# Altium schematic sheet Power.SchDoc
size A3; SheetNumber: 4; SheetTotal: 5
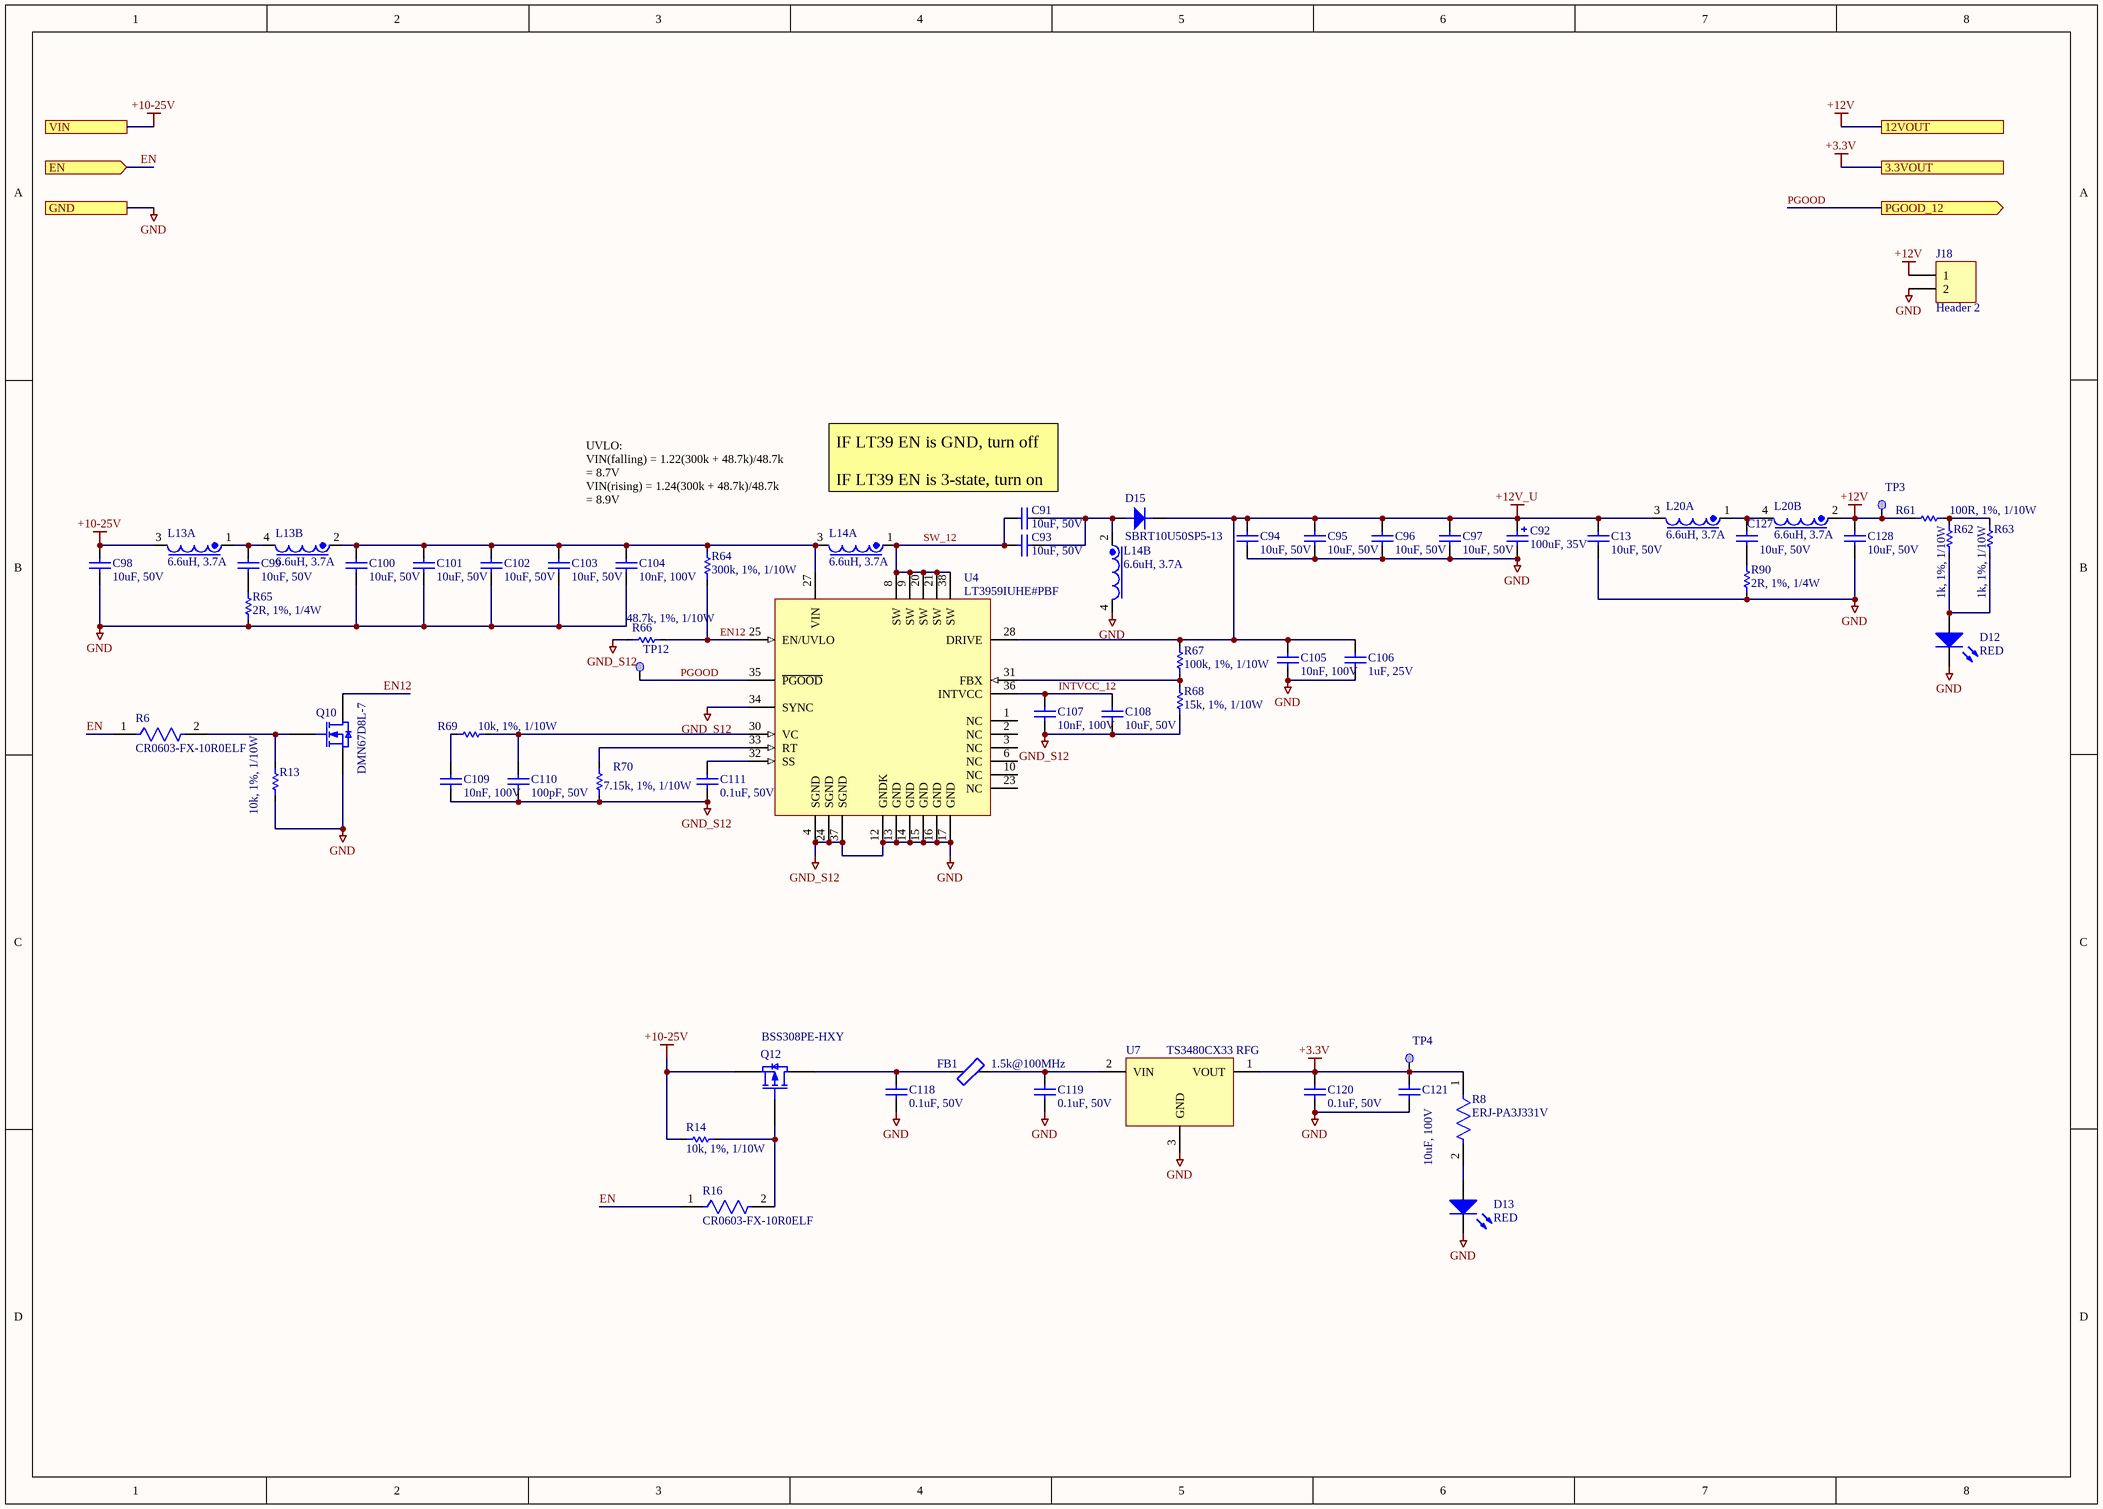
[diagram p0: Power.SchDoc]

## Parts
C13  10uF, 50V  [1206]
C91  10uF, 50V  [1206]
C92  100uF, 35V  [CAPAE7866X80L]
C93  10uF, 50V  [1206]
C94  10uF, 50V  [1206]
C95  10uF, 50V  [1206]
C96  10uF, 50V  [1206]
C97  10uF, 50V  [1206]
C98  10uF, 50V  [1206]
C99  10uF, 50V  [1206]
C100  10uF, 50V  [1206]
C101  10uF, 50V  [1206]
C102  10uF, 50V  [1206]
C103  10uF, 50V  [1206]
C104  10nF, 100V  [0603]
C105  10nF, 100V  [0603]
C106  1uF, 25V  [0603]
C107  10nF, 100V  [0603]
C108  10uF, 50V  [1206]
C109  10nF, 100V  [0603]
C110  100pF, 50V  [0603]
C111  0.1uF, 50V  [0603]
C118  0.1uF, 50V  [0603]
C119  0.1uF, 50V  [0603]
C120  0.1uF, 50V  [0603]
C121  10uF, 100V  [1210]
C127  10uF, 50V  [1206]
C128  10uF, 50V  [1206]
D12  RED  [0603_DIODE_K1A2]
D13  RED  [0603_DIODE_K1A2]
D15  SBRT10U50SP5-13  [DPAK184P650X115-3L]
FB1  1.5k@100MHz  [0805]
J18  Header 2  [CONN-TH_2P-P2.50_HX25003-2A]
L13  6.6uH, 3.7A  [PLCC300P1250X1250X600-4N]  (parts A,B of 2)
L14  6.6uH, 3.7A  [PLCC300P1250X1250X600-4N]  (parts A,B of 2)
L20  6.6uH, 3.7A  [PLCC300P1250X1250X600-4N]  (parts A,B of 2)
Q10  DMN67D8L-7  [SOT23-3]
Q12  BSS308PE-HXY  [SOT23-3]
R6  CR0603-FX-10R0ELF  [FP-CR0603-MFG]
R8  ERJ-PA3J331V  [FP-ERJPA3-MFG]
R13  10k, 1%, 1/10W  [0603]
R14  10k, 1%, 1/10W  [0603]
R16  CR0603-FX-10R0ELF  [FP-CR0603-MFG]
R61  100R, 1%, 1/10W  [0603]
R62  1k, 1%, 1/10W  [0603]
R63  1k, 1%, 1/10W  [0603]
R64  300k, 1%, 1/10W  [0603]
R65  2R, 1%, 1/4W  [1206]
R66  48.7k, 1%, 1/10W  [0603]
R67  100k, 1%, 1/10W  [0603]
R68  15k, 1%, 1/10W  [0603]
R69  10k, 1%, 1/10W  [0603]
R70  7.15k, 1%, 1/10W  [0603]
R90  2R, 1%, 1/4W  [1206]
TP3  Test Point  [TEST POINT 40 Mil]  (value not drawn)  (no BOM)
TP4  Test Point  [TEST POINT 40 Mil]  (value not drawn)  (no BOM)
TP12  Test Point  [TEST POINT 40 Mil]  (value not drawn)  (no BOM)
U4  LT3959IUHE#PBF  [QFN50P500X600X80_LT_UHEMA]
U7  TS3480CX33 RFG  [SOT23-3]

## Ports
3.3VOUT, 12VOUT, EN (in), GND, PGOOD_12 (out), VIN

## Nets
+3.3V: C120.1 C121.2 R8.1 TP4.1 U7.1(VOUT) ; port 3.3VOUT
+10-25V: C98.2 L13.3 Q12.3(S) R14.1 ; port VIN
+12V: C128.2 J18.1 L20.2 R61.2 TP3.1 ; port 12VOUT
+12V_U: C13.2 C92.1 C94.2 C95.2 C96.2 C97.2 C105.2 C106.2 D15.2(K) L20.3 R67.2 U4.28(DRIVE)
GND: C13.1 C92.2 C94.1 C95.1 C96.1 C97.1 C98.1 C100.1 C101.1 C102.1 C103.1 C104.1 C105.1 C106.1 C107.1 C108.1 C109.1 C110.1 C111.2 C118.2 C119.2 C120.2 C121.1 C128.1 D12.2(K) D13.2(K) J18.2 L14.4 Q10.2(S) R13.2 R65.1 R66.2 R68.1 R70.1 R90.1 U4.4(SGND) U4.12(GNDK) U4.13(GND) U4.14(GND) U4.15(GND) U4.16(GND) U4.17(GND) U4.24(SGND) U4.34(SYNC) U4.37(SGND) U7.3(GND) ; port GND  [also labelled GND_S12]
EN: R6.1 R16.1 ; port EN
EN12: Q10.3(D) R64.1 R66.1 U4.25(EN/UVLO)
INTVCC_12: C107.2 C108.2 U4.36(INTVCC)
PGOOD: TP12.1 U4.35(~{PGOOD}) ; port PGOOD_12
SW_12: C91.1 C93.1 L14.1 U4.8(SW) U4.9(SW) U4.20(SW) U4.21(SW) U4.38(SW)
NetC91_2: C91.2 C93.2 D15.1(A) L14.2
NetC99_1: C99.1 R65.2
NetC99_2: C99.2 L13.1 L13.4
NetC100_2: C100.2 C101.2 C102.2 C103.2 C104.2 L13.2 L14.3 R64.2 U4.27(VIN)
NetC109_2: C109.2 R69.2
NetC110_2: C110.2 R69.1 U4.30(VC)
NetC111_1: C111.1 U4.32(SS)
NetC118_1: C118.1 FB1.1 Q12.2(D)
NetC119_1: C119.1 FB1.2 U7.2(VIN)
NetC127_1: C127.1 R90.2
NetC127_2: C127.2 L20.1 L20.4
NetD12_1: D12.1(A) R62.2 R63.2
NetD13_1: D13.1(A) R8.2
NetQ10_1: Q10.1(G) R6.2 R13.1
NetQ12_1: Q12.1(G) R14.2 R16.2
NetR61_1: R61.1 R62.1 R63.1
NetR67_1: R67.1 R68.2 U4.31(FBX)
NetR70_2: R70.2 U4.33(RT)

Not connected (* = marked no-connect by the designer): U4 1(NC) 2(NC) 3(NC) 6(NC) 10(NC) 23(NC)

## Notes on the sheet
- (near C91) IF LT39 EN is GND, turn off
  IF LT39 EN is 3-state, turn on
- UVLO:
  VIN(falling) = 1.22(300k + 48.7k)/48.7k
  = 8.7V
  VIN(rising) = 1.24(300k + 48.7k)/48.7k
  = 8.9V

## Library data of the parts
C13 C91 C93-C103 C108 C127 C128 = NS00832: CAP CER 10UF 50V X7R 1206; Type: C; Alternatives: Generic; Part Number: NS00832; Value: 10uF, 50V; Supplier 1: Digi-Key; Supplier Part Number 1: 1276-6767-1-ND
C92 = NS00911: CAP ALUM 100UF 20% 35V SMD; Type: C; Alternatives: Generic; Part Number: NS00911; Value: 100uF, 35V; Supplier 1: Digi-Key; Supplier Part Number 1: PCE5051CT-ND
C104 C105 C107 C109 = NS00848: CAP CER 10000PF 100V C0G 0603; Type: C; Alternatives: Generic; Part Number: NS00848; Value: 10nF, 100V; Supplier 1: Digi-Key; Supplier Part Number 1: 445-172665-1-ND
C106 = NS00836: CAP CER 1UF 25V X7R 0603; Type: C; Alternatives: Generic; Part Number: NS00836; Value: 1uF, 25V; Supplier 1: Digi-Key; Supplier Part Number 1: 1276-1184-1-ND
C110 = NS00840: CAP CER 100PF 50V C0G/NP0 0603; Type: C; Alternatives: Generic; Part Number: NS00840; Value: 100pF, 50V; Supplier 1: Digi-Key; Supplier Part Number 1: 478-1175-1-ND
C111 C118-C120 = NS00838: CAP CER 0.1UF 50V X7R 0603; Type: C; Alternatives: Generic; Part Number: NS00838; Value: 0.1uF, 50V; Supplier 1: Digi-Key; Supplier Part Number 1: 1276-1935-1-ND
C121 = NS00779: MLCC 10UF 100V X7S 1210; Type: C; Alternatives: Generic; Part Number: NS00779; Value: 10uF, 100V; Supplier 1: Digi-Key; Supplier Part Number 1: 1276-CL32Y106KCVZNWECT-ND
D12 D13 = NS00945: LED RED CLEAR 1608 SMD; Type: IC; Part Number: NS00945; Value: RED; ComponentLink1Description: Datasheet; ComponentLink1URL: H:\Doc\Harvatek\B1911USD-20D000114U1930.pdf; Supplier 1: Digi-Key; Supplier Part Number 1: 3147-B1911USD-20D000114U1930CT-ND
D15 = NS00833: DIODE SBR 50V 10A POWERDI5; Part Number: NS00833; Type: Diode; Value: SBRT10U50SP5-13; ComponentLink1Description: Datasheet; ComponentLink1URL: H:\Doc\Diodes\SBRT10U50SP5.pdf; Supplier 1: Digi-Key; Supplier Part Number 1: SBR10E45P5-7DICT-ND
FB1 = NS00881: WE-CBA SMT EMI SUPPRESSION FERRITE; Type: Inductor; Part Number: NS00881; Value: 1.5k@100MHz; ComponentLink1Description: Datasheet; ComponentLink1URL: H:\Doc\Wurth\782853162.pdf; Supplier 1: Digi-Key; Supplier Part Number 1: 732-782853162CT-ND
J18 = Header 2: Header, 2-Pin; LatestRevisionDate: 17-Jul-2002; LatestRevisionNote: Re-released for DXP Platform.; Publisher: Altium Limited; Supplier 1: Digi-Key; Supplier Part Number 1: 455-B2B-XH-A-ND
L13 L14 L20 = NS00831: INDUCT ARRAY 2 COIL 6.6UH SMD; Type: Inductor; Part Number: NS00831; Value: 6.6uH, 3.7A; ComponentLink1Description: Datasheet; ComponentLink1URL: H:\Doc\pulse\SPM2007_28.pdf; Supplier 1: Digi-Key; Supplier Part Number 1: 553-3631-ND
Q10 = NS00873: MOSFET N-CH 60V 210MA SOT23; Type: IC; Published: 8-Jun-2000; LatestRevisionDate: 17-Jul-2002; LatestRevisionNote: Re-released for DXP Platform.; PackageVersion: 1995/1996; PackageReference: E3; Publisher: Altium Limited; Part Number: NS00873; Value: DMN67D8L-7; ComponentLink1Description: Datasheet; ComponentLink1URL: H:\Doc\Diodes\DMN67D8L.pdf; Supplier 1: Digi-Key; Supplier Part Number 1: DMN67D8L-7DICT-ND
Q12 = NS00810: P-CHANNEL MOSFET; Type: IC; Part Number: NS00810; Value: BSS308PE-HXY; ComponentLink1Description: Datasheet; ComponentLink1URL: H:\Doc\MicroCommercial\MCU45P03A(DPAK).pdf; Supplier 1: Digi-Key; Supplier Part Number 1: 353-MCU45P03A-TPCT-ND
R6 R16 = CMP-1012-00284-2: Thick Film Chip Resistors 0603 10Ω 0.1W 1% 100ppm/°C; Max Power Dissipation: 100mW; Resistance: 10R; Voltage Rating: 50V; Depth: 0.8mm; REACH SVHC: No SVHC; Package Quantity: 1; Thickness: 457um; Length: 1.6mm; Tolerance: 1%; Width: 0.8mm; Number of Pins: 2; Height: 0.45mm; Military Standard: Not; Features: Moisture Resistant; Packaging: Tape and Reel; Case/Package: 0603; Power Rating: 100mW; Voltage Rating (DC): 50V; Radiation Hardening: No; Mount: Surface Mount; Min Operating Temperature: -55°C; Composition: Thick Film; Max Operating Temperature: 155°C; Termination: SMD/SMT; Temperature Coefficient: 100ppm/°C; Case Code (Imperial): 0603; Case Code (Metric): 1608; Number of Terminations: 2; Contact Plating: Tin
R8 = CMP-05422-000096-1: RES SMD 330 OHM 5% 1/4W 0603; Resistance: 330R; Temperature Coefficient: 200ppm/°C; Max Power Dissipation: 250mW; Case Code (Imperial): 0603; Height: 0.018inch; Case/Package: 0603; Case Code (Metric): 1608; Width: 0.031inch; Length: 0.063inch; Tolerance: 5%; Features: Automotive AEC-Q200; Min Operating Temperature: -55°C; Max Operating Temperature: 155°C; Resistor Type: Thick Film; Packaging: Cut Tape; Number of Terminations: 2; Parameter 1: *; Parameter 2: *
R13 R14 R69 = NS00820: RES 10K OHM 1% 1/10W 0603; Alternatives: Generic; Part Number: NS00820; Type: R; Value: 10k, 1%, 1/10W; Supplier 1: Digi-Key; Supplier Part Number 1: RMCF0603FT10K0CT-ND
R61 = NS00870: RES 100 OHM 1% 1/10W 0603; Alternatives: Generic; Part Number: NS00870; Type: R; Value: 100R, 1%, 1/10W; Supplier 1: Digi-Key; Supplier Part Number 1: RMCF0603FT100RCT-ND
R62 R63 = NS00882: RES 1K OHM 1% 1/10W 0603; Alternatives: Generic; Part Number: NS00882; Type: R; Value: 1k, 1%, 1/10W; Supplier 1: Digi-Key; Supplier Part Number 1: RMCF0603FT1K00CT-ND
R64 = NS00837: RES 300K OHM 1% 1/10W 0603; Alternatives: Generic; Part Number: NS00837; Type: R; Value: 300k, 1%, 1/10W; Supplier 1: Digi-Key; Supplier Part Number 1: RMCF0603FT300KCT-ND
R65 R90 = NS00946: RES 2 OHM 1% 1/4W 1206; Alternatives: Generic; Part Number: NS00946; Type: R; Value: 2R, 1%, 1/4W; Supplier 1: Digi-Key; Supplier Part Number 1: 738-RMCF1206FT2R00CT-ND
R66 = NS00826: RES 48.7K OHM 1% 1/10W 0603; Alternatives: Generic; Part Number: NS00826; Type: R; Value: 48.7k, 1%, 1/10W; Supplier 1: Digi-Key; Supplier Part Number 1: RMCF0603FT48K7CT-ND
R67 = NS00835: RES 100K OHM 1% 1/10W 0603; Alternatives: Generic; Part Number: NS00835; Type: R; Value: 100k, 1%, 1/10W; Supplier 1: Digi-Key; Supplier Part Number 1: RMCF0603FT100KCT-ND
R68 = NS00834: RES 15K OHM 1% 1/10W 0603; Alternatives: Generic; Part Number: NS00834; Type: R; Value: 15k, 1%, 1/10W; Supplier 1: Digi-Key; Supplier Part Number 1: 1292-WR06X1502FTLCT-ND
R70 = NS00839: RES 7.15K OHM 1% 1/10W 0603; Alternatives: Generic; Part Number: NS00839; Type: R; Value: 7.15k, 1%, 1/10W; Supplier 1: Digi-Key; Supplier Part Number 1: RMCF0603FT7K15CT-ND
TP3 TP4 TP12 = Test Point: Test Point 0.3mm; PartType: Mechanical; ComponentLink1Description: Datasheet
U4 = NS00829: IC REG MULTI CONFG ADJ 6A 36QFN; Part Number: NS00829; Type: IC; Value: LT3959IUHE#PBF; ComponentLink1Description: Datasheet; ComponentLink1URL: H:\Doc\Linear_Technologies\3959fa.pdf; Supplier 1: Digi-Key; Supplier Part Number 1: 505-LT3959IUHE#PBF-ND
U7 = NS00929: IC REG LINEAR 3.3V 100MA SOT23; Part Number: NS00929; Type: IC; Value: TS3480CX33 RFG; ComponentLink1Description: Datasheet; ComponentLink1URL: H:\Doc\TaiwanSemi\TS3480.pdf; Supplier 1: Digi-Key; Supplier Part Number 1: TS3480CX33RFGCT-ND